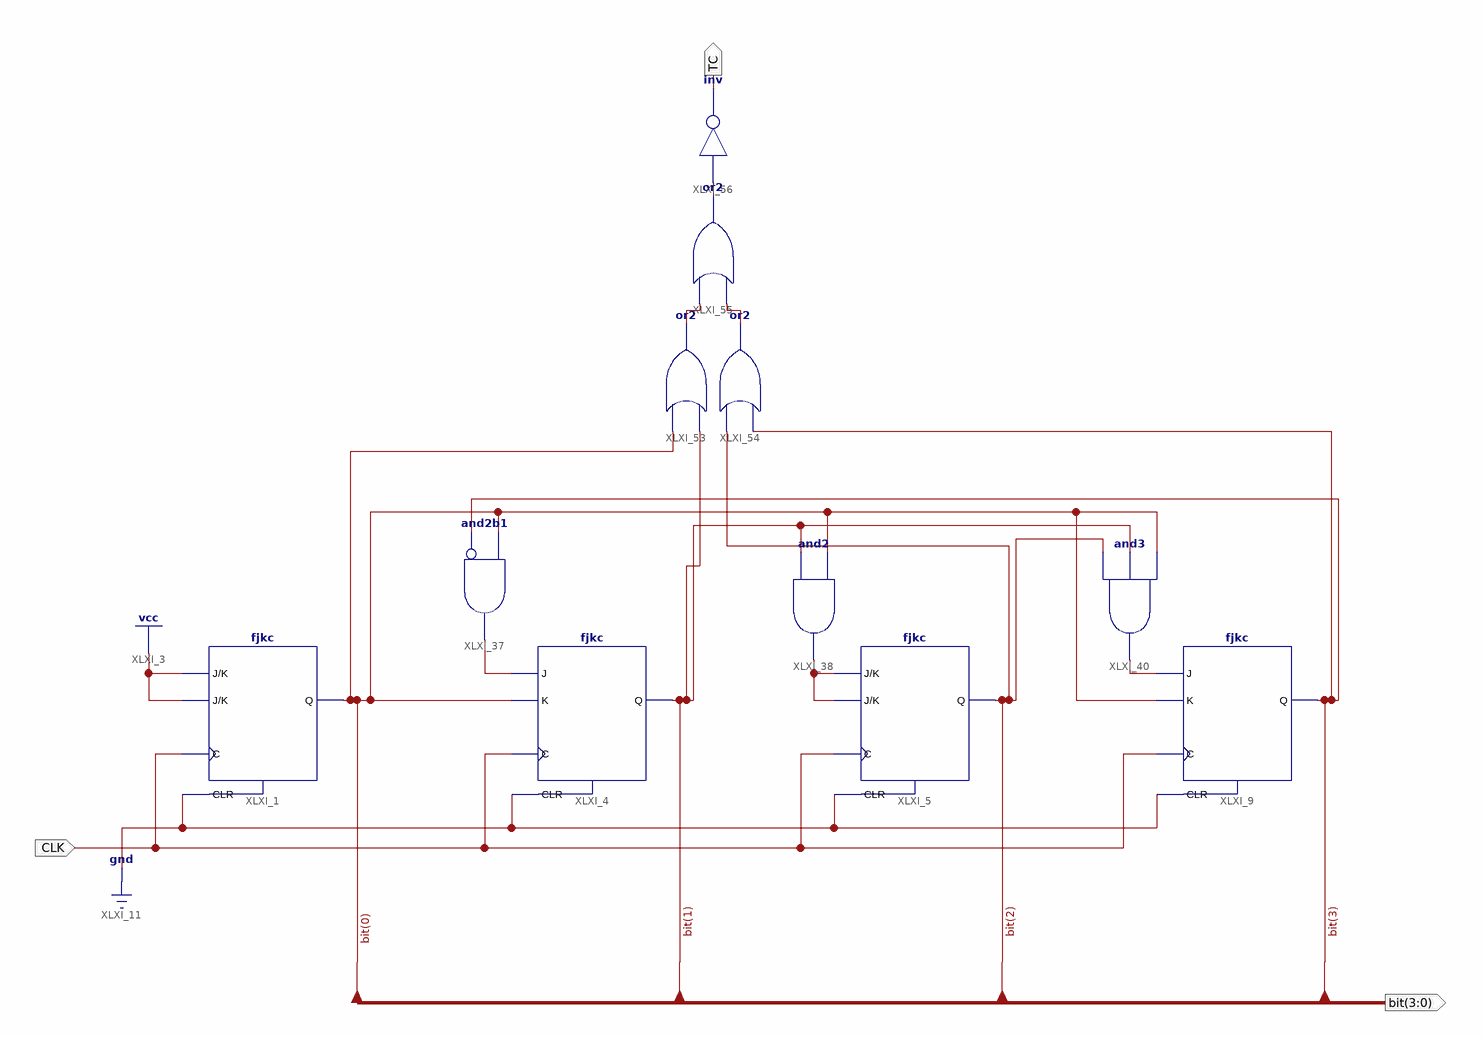
[diagram p0: schematic sheet 1]
// Xilinx ISE schematic counter0_9.sch (spartan6) as structural Verilog: 11 symbols, 3 ports
module counter0_9 (
  input  CLK,
  output [3:0] \bit ,
  output TC
);

  wire XLXN_62, XLXN_63, XLXN_65, XLXN_93, XLXN_95, XLXN_96;

  fjkc XLXI_1 (.C(CLK), .CLR(1'b0), .J(1'b1), .K(1'b1), .Q(\bit [0]));
  fjkc XLXI_4 (.C(CLK), .CLR(1'b0), .J(XLXN_62), .K(\bit [0]), .Q(\bit [1]));
  fjkc XLXI_5 (.C(CLK), .CLR(1'b0), .J(XLXN_63), .K(XLXN_63), .Q(\bit [2]));
  fjkc XLXI_9 (.C(CLK), .CLR(1'b0), .J(XLXN_65), .K(\bit [0]), .Q(\bit [3]));
  and XLXI_37 (XLXN_62, ~\bit [3], \bit [0]);  // and2b1
  and XLXI_38 (XLXN_63, \bit [1], \bit [0]);
  and XLXI_40 (XLXN_65, \bit [2], \bit [1], \bit [0]);
  or XLXI_53 (XLXN_95, \bit [1], \bit [0]);
  or XLXI_54 (XLXN_96, \bit [3], \bit [2]);
  or XLXI_55 (XLXN_93, XLXN_96, XLXN_95);
  not XLXI_56 (TC, XLXN_93);
endmodule
